# Altium schematic sheet Project_Example_V1.SchDoc
size Letter; CheckedBy: Pablo M.; DocumentNumber: 5; Revision: v1; SheetNumber: 5; SheetTotal: 5
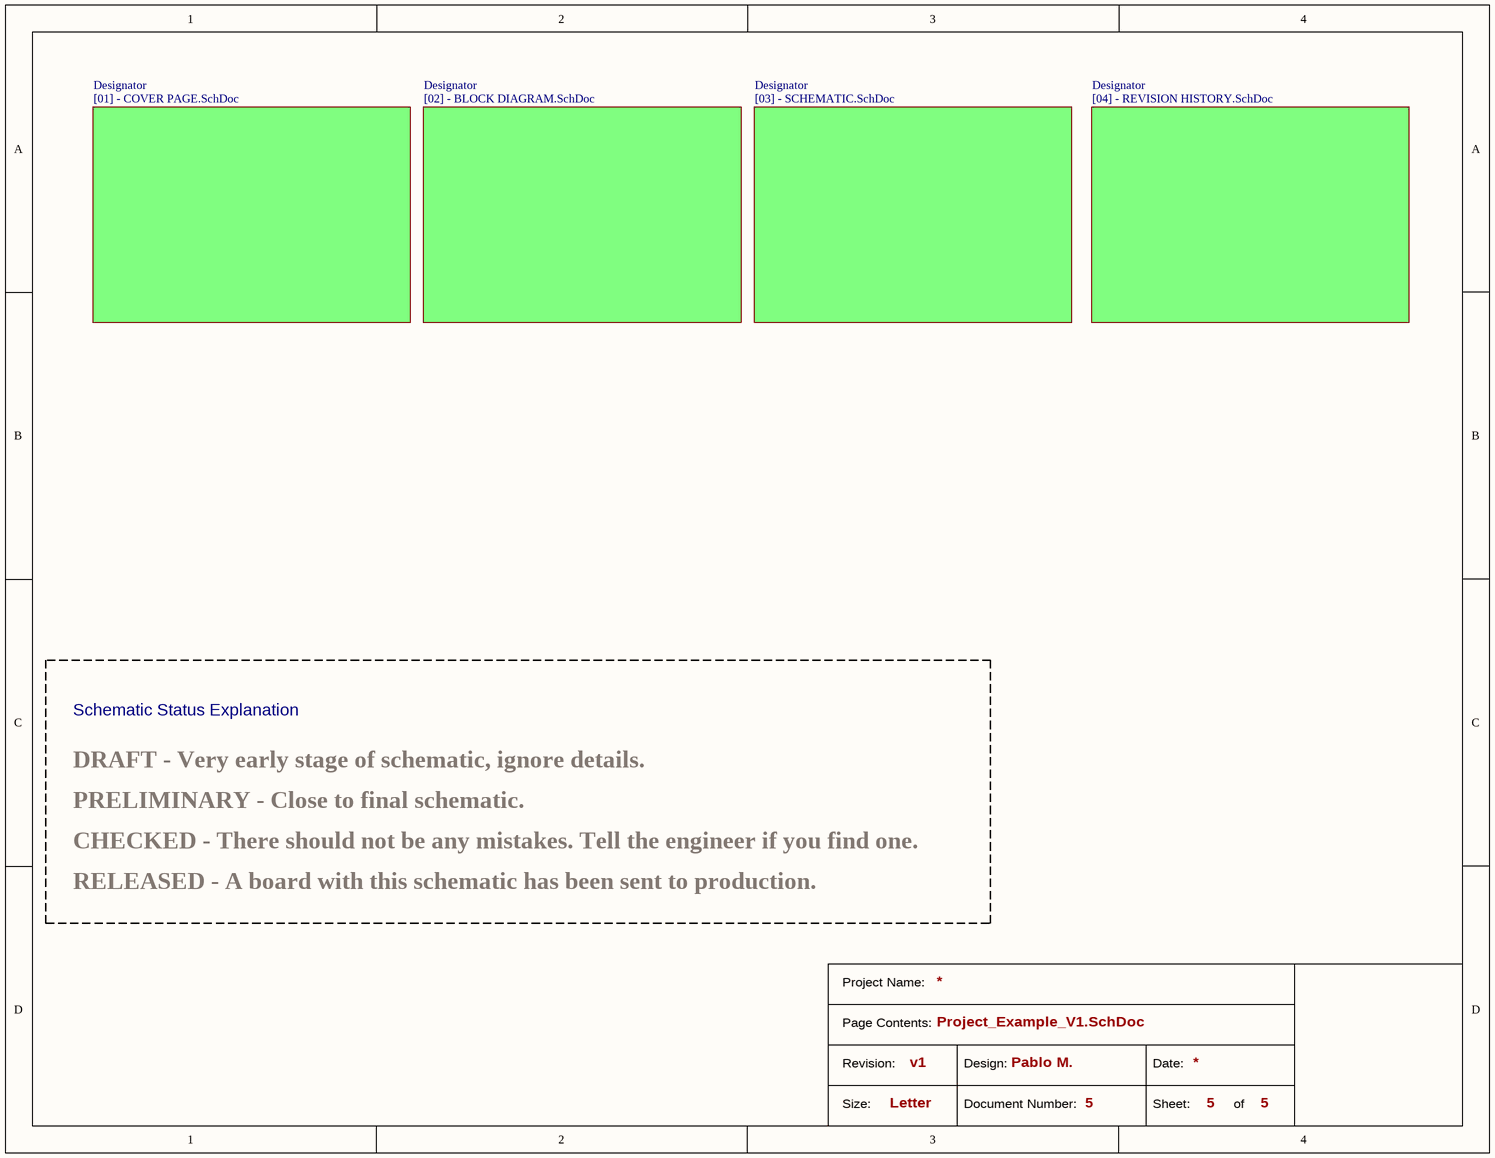
[diagram p0: Project_Example_V1.SchDoc]

## Sub-sheets
Designator = [01] - COVER PAGE.SchDoc: no entries
Designator = [02] - BLOCK DIAGRAM.SchDoc: no entries
Designator = [03] - SCHEMATIC.SchDoc: no entries
Designator = [04] - REVISION HISTORY.SchDoc: no entries

## Notes on the sheet
- Schematic Status Explanation
- DRAFT - Very early stage of schematic, ignore details.
- PRELIMINARY - Close to final schematic.
- RELEASED - A board with this schematic has been sent to production.
- CHECKED - There should not be any mistakes. Tell the engineer if you find one.
- Project Name:
- Page Contents:
- Size:
- Revision:
- Letter
- Design:
- Document Number:
- Date:
- Sheet:
- of